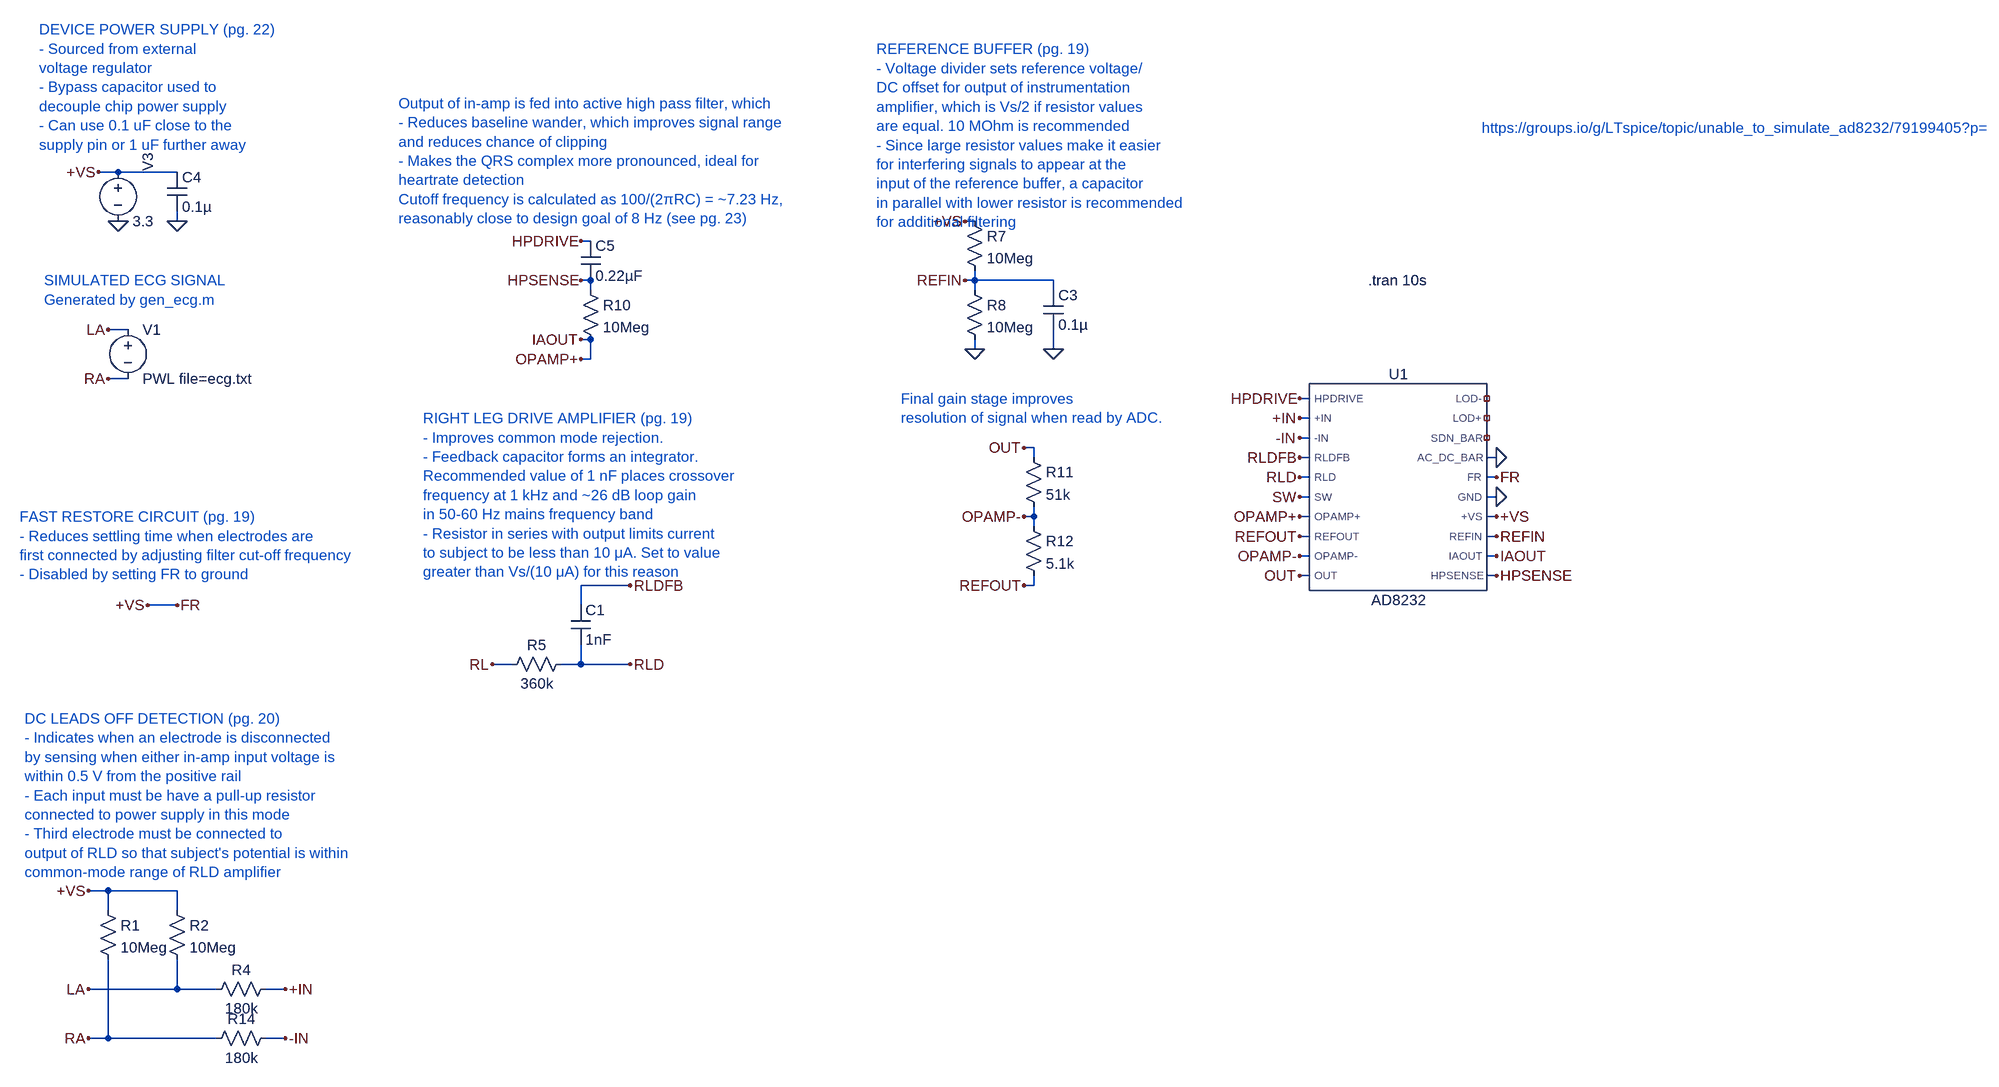
[diagram p0: schematic ecg_sim.asc]
ecg_sim.asc, the LTspice schematic file:
Version 4
SHEET 1 2600 1264
WIRE -544 -208 -576 -208
WIRE -448 -208 -544 -208
WIRE -448 -128 -448 -144
WIRE 848 -128 832 -128
WIRE 224 -96 208 -96
WIRE 224 -32 208 -32
WIRE 848 -32 848 -48
WIRE 848 -32 832 -32
WIRE 976 -32 848 -32
WIRE 224 -16 224 -32
WIRE 848 -16 848 -32
WIRE 976 -16 976 -32
WIRE -528 48 -560 48
WIRE 224 64 208 64
WIRE 848 80 848 64
WIRE 976 80 976 48
WIRE 224 96 224 64
WIRE 224 96 208 96
WIRE -528 128 -560 128
WIRE 1392 160 1376 160
WIRE 1392 192 1376 192
WIRE 1392 224 1376 224
WIRE 944 240 928 240
WIRE 944 256 944 240
WIRE 1392 256 1376 256
WIRE 1696 256 1680 256
WIRE 1392 288 1376 288
WIRE 1696 288 1680 288
WIRE 1392 320 1376 320
WIRE 1696 320 1680 320
WIRE 944 352 944 336
WIRE 944 352 928 352
WIRE 1392 352 1376 352
WIRE 1696 352 1680 352
WIRE 944 368 944 352
WIRE 1392 384 1376 384
WIRE 1696 384 1680 384
WIRE 1392 416 1376 416
WIRE 1696 416 1680 416
WIRE 1392 448 1376 448
WIRE 1696 448 1680 448
WIRE 288 464 208 464
WIRE 944 464 944 448
WIRE 944 464 928 464
WIRE -448 496 -496 496
WIRE 208 496 208 464
WIRE 96 592 64 592
WIRE 208 592 208 560
WIRE 208 592 176 592
WIRE 288 592 208 592
WIRE -560 960 -592 960
WIRE -448 960 -560 960
WIRE -560 992 -560 960
WIRE -448 992 -448 960
WIRE -448 1120 -448 1072
WIRE -448 1120 -592 1120
WIRE -384 1120 -448 1120
WIRE -272 1120 -304 1120
WIRE -560 1200 -560 1072
WIRE -560 1200 -592 1200
WIRE -384 1200 -560 1200
WIRE -272 1200 -304 1200
FLAG -560 48 LA
FLAG 1376 192 +IN
FLAG 1376 224 -IN
FLAG 1376 160 HPDRIVE
FLAG 1376 256 RLDFB
FLAG 1376 288 RLD
FLAG 1696 320 0
FLAG 1696 352 +VS
FLAG 1696 448 HPSENSE
FLAG 1696 384 REFIN
FLAG 1376 320 SW
FLAG 1376 352 OPAMP+
FLAG 1376 384 REFOUT
FLAG 1696 416 IAOUT
FLAG 1376 416 OPAMP-
FLAG 1376 448 OUT
FLAG -560 128 RA
FLAG 208 -96 HPDRIVE
FLAG 208 -32 HPSENSE
FLAG 64 592 RL
FLAG 208 64 IAOUT
FLAG 1696 256 0
FLAG 208 96 OPAMP+
FLAG 928 352 OPAMP-
FLAG 928 464 REFOUT
FLAG 928 240 OUT
FLAG -544 -128 0
FLAG -576 -208 +VS
FLAG -448 -128 0
FLAG 288 464 RLDFB
FLAG 288 592 RLD
FLAG 832 -128 +VS
FLAG 832 -32 REFIN
FLAG 848 80 0
FLAG 976 80 0
FLAG 1696 288 FR
FLAG -592 960 +VS
FLAG -272 1120 +IN
FLAG -272 1200 -IN
FLAG -592 1120 LA
FLAG -592 1200 RA
FLAG -496 496 +VS
FLAG -448 496 FR
SYMBOL voltage -528 32 R0
WINDOW 123 0 0 Left 0
WINDOW 39 0 0 Left 0
SYMATTR InstName V1
SYMATTR Value PWL file=ecg.txt
SYMBOL AD8232 1536 304 R0
SYMATTR InstName U1
SYMBOL res 832 -144 R0
SYMATTR InstName R7
SYMATTR Value 10Meg
SYMBOL res 832 -32 R0
SYMATTR InstName R8
SYMATTR Value 10Meg
SYMBOL cap 960 -16 R0
SYMATTR InstName C3
SYMATTR Value 0.1µ
SYMBOL cap 208 -96 R0
SYMATTR InstName C5
SYMATTR Value 0.22µF
SYMBOL cap 192 496 R0
SYMATTR InstName C1
SYMATTR Value 1nF
SYMBOL res 192 576 R90
WINDOW 0 0 56 VBottom 2
WINDOW 3 32 56 VTop 2
SYMATTR InstName R5
SYMATTR Value 360k
SYMBOL res 208 -32 R0
SYMATTR InstName R10
SYMATTR Value 10Meg
SYMBOL res 928 240 R0
SYMATTR InstName R11
SYMATTR Value 51k
SYMBOL res 928 352 R0
SYMATTR InstName R12
SYMATTR Value 5.1k
SYMBOL voltage -544 -224 R0
WINDOW 0 48 15 VLeft 2
SYMATTR InstName V3
SYMATTR Value 3.3
SYMBOL Cap -464 -208 R0
SYMATTR InstName C4
SYMATTR Value 0.1µ
SYMBOL Res -576 976 R0
SYMATTR InstName R1
SYMATTR Value 10Meg
SYMBOL Res -464 976 R0
SYMATTR InstName R2
SYMATTR Value 10Meg
SYMBOL Res -288 1104 R90
WINDOW 0 0 56 VBottom 2
WINDOW 3 32 56 VTop 2
SYMATTR InstName R4
SYMATTR Value 180k
SYMBOL Res -288 1184 R90
WINDOW 0 0 56 VBottom 2
WINDOW 3 32 56 VTop 2
SYMATTR InstName R14
SYMATTR Value 180k
TEXT 1488 -32 Left 2 !.tran 10s
TEXT 1672 -280 Left 2 ;https://groups.io/g/LTspice/topic/unable_to_simulate_ad8232/79199405?p=
TEXT -88 -320 Left 2 ;Output of in-amp is fed into active high pass filter, which\n- Reduces baseline wander, which improves signal range\nand reduces chance of clipping\n- Makes the QRS complex more pronounced, ideal for\nheartrate detection\nCutoff frequency is calculated as 100/(2πRC) = ~7.23 Hz, \nreasonably close to design goal of 8 Hz (see pg. 23)
TEXT 728 160 Left 2 ;Final gain stage improves\nresolution of signal when read by ADC.
TEXT -672 -440 Left 2 ;DEVICE POWER SUPPLY (pg. 22)\n- Sourced from external \nvoltage regulator\n- Bypass capacitor used to\ndecouple chip power supply\n- Can use 0.1 uF close to the\nsupply pin or 1 uF further away
TEXT -664 -32 Left 2 ;SIMULATED ECG SIGNAL\nGenerated by gen_ecg.m
TEXT -48 192 Left 2 ;RIGHT LEG DRIVE AMPLIFIER (pg. 19)\n- Improves common mode rejection.\n- Feedback capacitor forms an integrator.\nRecommended value of 1 nF places crossover\nfrequency at 1 kHz and ~26 dB loop gain\nin 50-60 Hz mains frequency band\n- Resistor in series with output limits current\nto subject to be less than 10 μA. Set to value\ngreater than Vs/(10 μA) for this reason
TEXT 688 -408 Left 2 ;REFERENCE BUFFER (pg. 19)\n- Voltage divider sets reference voltage/\nDC offset for output of instrumentation\namplifier, which is Vs/2 if resistor values\nare equal. 10 MOhm is recommended\n- Since large resistor values make it easier\nfor interfering signals to appear at the\ninput of the reference buffer, a capacitor\nin parallel with lower resistor is recommended\nfor additional filtering
TEXT -696 680 Left 2 ;DC LEADS OFF DETECTION (pg. 20)\n- Indicates when an electrode is disconnected\nby sensing when either in-amp input voltage is\nwithin 0.5 V from the positive rail\n- Each input must be have a pull-up resistor\nconnected to power supply in this mode\n- Third electrode must be connected to\noutput of RLD so that subject's potential is within\ncommon-mode range of RLD amplifier
TEXT -704 352 Left 2 ;FAST RESTORE CIRCUIT (pg. 19)\n- Reduces settling time when electrodes are\nfirst connected by adjusting filter cut-off frequency\n- Disabled by setting FR to ground

The netlist it stands for:
* ecg_sim.asc
V1 LA RA PWL file=ecg.txt
XU1 HPDRIVE +IN -IN RLDFB RLD SW IAOUT REFOUT OPAMP- OUT NC_01 NC_02 NC_03 0 FR 0 FR REFIN IAOUT HPSENSE AD8232  ; pins HPDRIVE +IN -IN RLDFB RLD SW OPAMP+ REFOUT OPAMP- OUT LOD- LOD+ SDN_BAR AC_DC_BAR FR GND +VS REFIN IAOUT HPSENSE
R7 FR REFIN 10Meg
R8 REFIN 0 10Meg
C3 REFIN 0 0.1µ
C5 HPDRIVE HPSENSE 0.22µF
C1 RLDFB RLD 1nF
R5 RLD RL 360k
R10 HPSENSE IAOUT 10Meg
R11 OUT OPAMP- 51k
R12 OPAMP- REFOUT 5.1k
V3 FR 0 3.3
C4 FR 0 0.1µ
R1 FR RA 10Meg
R2 FR LA 10Meg
R4 +IN LA 180k
R14 -IN RA 180k
.tran 10s
* https://groups.io/g/LTspice/topic/unable_to_simulate_ad8232/79199405?p=
* Output of in-amp is fed into active high pass filter, which
* - Reduces baseline wander, which improves signal range
* and reduces chance of clipping
* - Makes the QRS complex more pronounced, ideal for
* heartrate detection
* Cutoff frequency is calculated as 100/(2πRC) = ~7.23 Hz,
* reasonably close to design goal of 8 Hz (see pg. 23)
* Final gain stage improves
* resolution of signal when read by ADC.
* DEVICE POWER SUPPLY (pg. 22)
* - Sourced from external
* voltage regulator
* - Bypass capacitor used to
* decouple chip power supply
* - Can use 0.1 uF close to the
* supply pin or 1 uF further away
* SIMULATED ECG SIGNAL
* Generated by gen_ecg.m
* RIGHT LEG DRIVE AMPLIFIER (pg. 19)
* - Improves common mode rejection.
* - Feedback capacitor forms an integrator.
* Recommended value of 1 nF places crossover
* frequency at 1 kHz and ~26 dB loop gain
* in 50-60 Hz mains frequency band
* - Resistor in series with output limits current
* to subject to be less than 10 μA. Set to value
* greater than Vs/(10 μA) for this reason
* REFERENCE BUFFER (pg. 19)
* - Voltage divider sets reference voltage/
* DC offset for output of instrumentation
* amplifier, which is Vs/2 if resistor values
* are equal. 10 MOhm is recommended
* - Since large resistor values make it easier
* for interfering signals to appear at the
* input of the reference buffer, a capacitor
* in parallel with lower resistor is recommended
* for additional filtering
* DC LEADS OFF DETECTION (pg. 20)
* - Indicates when an electrode is disconnected
* by sensing when either in-amp input voltage is
* within 0.5 V from the positive rail
* - Each input must be have a pull-up resistor
* connected to power supply in this mode
* - Third electrode must be connected to
* output of RLD so that subject's potential is within
* common-mode range of RLD amplifier
* FAST RESTORE CIRCUIT (pg. 19)
* - Reduces settling time when electrodes are
* first connected by adjusting filter cut-off frequency
* - Disabled by setting FR to ground
.lib /Users/Steve/Repositories/ec-stingy/AD8232.cir
.backanno
.end